# EAGLE schematic miniBTX (EAGLE 6.5.0)
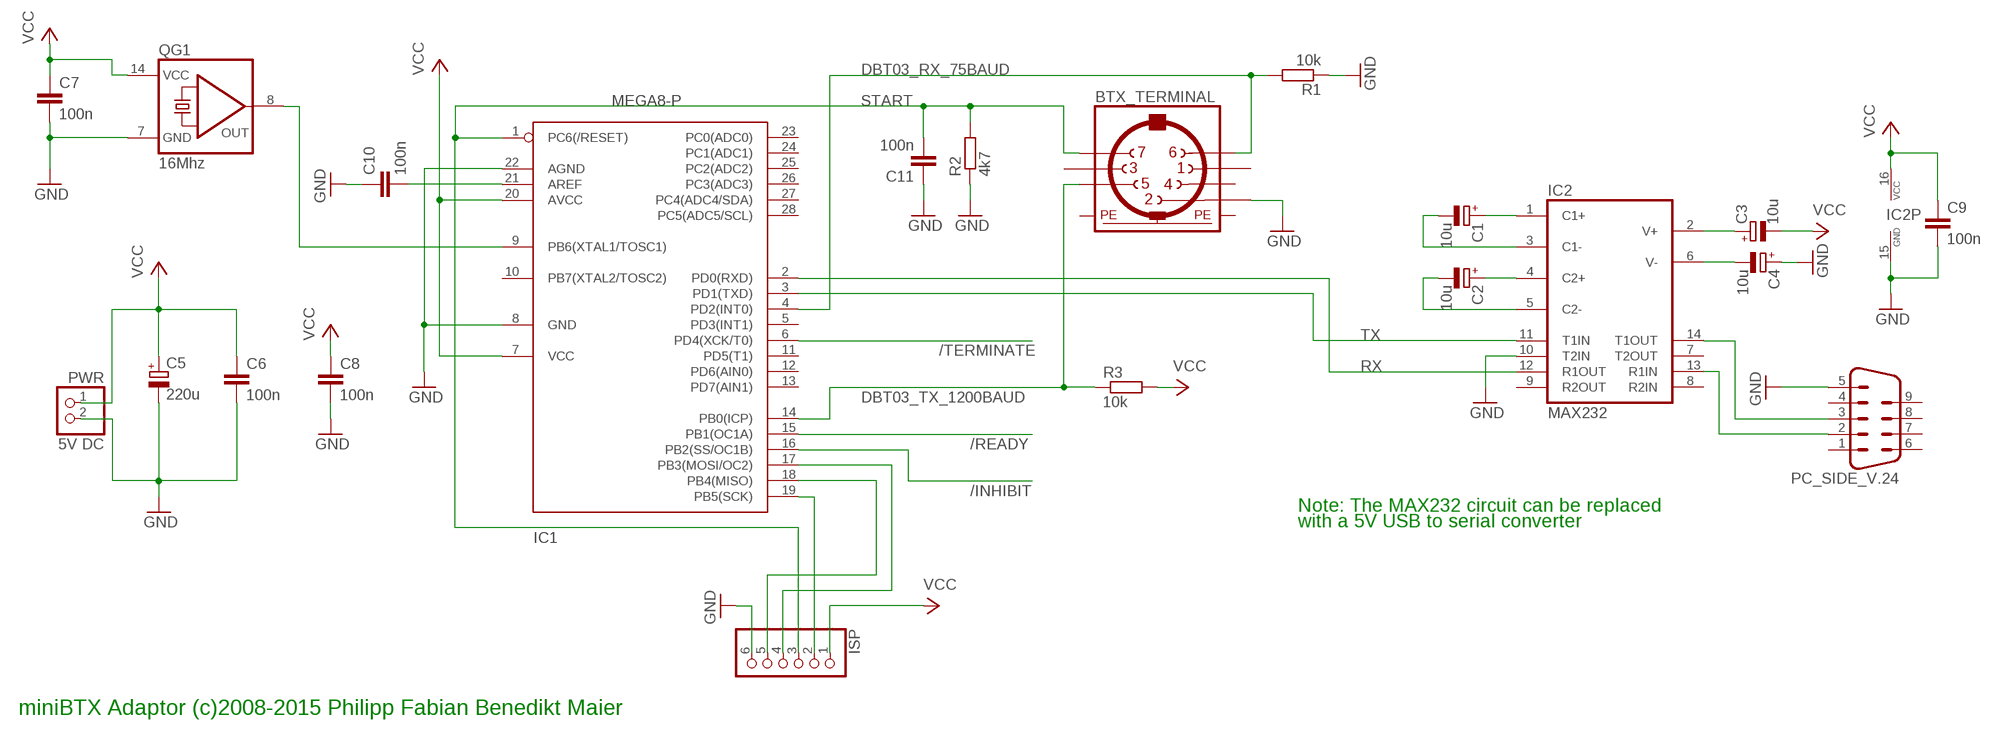
[diagram p0: schematic, sheet 1]

## Parts
BTX_TERMINAL  MAB7SH  [MAB7SH]
C1  10u  CPOL-EUE2,5-6E  [E2,5-6E]
C2  10u  CPOL-EUE2,5-6E  [E2,5-6E]
C3  10u  CPOL-EUE2,5-6E  [E2,5-6E]
C4  10u  CPOL-EUE2,5-6E  [E2,5-6E]
C5  220u  CPOL-EUE2,5-6E  [E2,5-6E]
C6  100n  C-EU025-024X044  [C025-024X044]
C7  100n  C-EU025-024X044  [C025-024X044]
C8  100n  C-EU025-024X044  [C025-024X044]
C9  100n  C-EU025-024X044  [C025-024X044]
C10  100n  C-EU025-024X044  [C025-024X044]
C11  100n  C-EU025-024X044  [C025-024X044]
IC1  MEGA8-P  [DIL28-3]
IC2  MAX232  [DIL16]
ISP  PINHD-1X6  [1X06]
PC_SIDE_V.24  M09HP  [M09HP]
PWR  5V DC  PINHD-1X2  [1X02]
QG1  16Mhz  QG5860  [DIL14S]
R1  10k  R-EU_0207/12  [0207/12]
R2  4k7  R-EU_0207/12  [0207/12]
R3  10k  R-EU_0207/12  [0207/12]

## Nets
/INHIBIT: IC1.16(PB2(SS/OC1B))
/READY: IC1.15(PB1(OC1A))
/TERMINATE: IC1.6(PD4(XCK/T0))
DBT03_RX_75BAUD: BTX_TERMINAL.6 IC1.4(PD2(INT0)) R1.2
DBT03_TX_1200BAUD: BTX_TERMINAL.5 IC1.14(PB0(ICP)) R3.1
GND: BTX_TERMINAL.2 C4.+ C5.- C6.2 C7.2 C8.2 C9.2 C10.1 C11.1 IC1.8(GND) IC1.22(AGND) IC2.10(T2IN) IC2.15(GND) ISP.6 PC_SIDE_V.24.5 PWR.2 QG1.7(GND) R1.1 R2.1
N$1: IC1.9(PB6(XTAL1/TOSC1)) QG1.8(OUT)
N$4: IC2.13(R1IN) PC_SIDE_V.24.2
N$5: C1.+ IC2.1(C1+)
N$6: C1.- IC2.3(C1-)
N$7: C2.+ IC2.4(C2+)
N$8: C2.- IC2.5(C2-)
N$9: C3.+ IC2.2(V+)
N$10: C4.- IC2.6(V-)
N$11: IC2.14(T1OUT) PC_SIDE_V.24.3
N$12: C10.2 IC1.21(AREF)
N$14: IC1.19(PB5(SCK)) ISP.2
N$16: IC1.17(PB3(MOSI/OC2)) ISP.4
N$17: IC1.18(PB4(MISO)) ISP.5
RX: IC1.2(PD0(RXD)) IC2.12(R1OUT)
START: BTX_TERMINAL.7 C11.2 IC1.1(PC6(/RESET)) ISP.3 R2.2
TX: IC1.3(PD1(TXD)) IC2.11(T1IN)
VCC: C3.- C5.+ C6.1 C7.1 C8.1 C9.1 IC1.7(VCC) IC1.20(AVCC) IC2.16(VCC) ISP.1 PWR.1 QG1.14(VCC) R3.2
Unconnected: BTX_TERMINAL.1 BTX_TERMINAL.3 BTX_TERMINAL.4 IC1.5(PD3(INT1)) IC1.10(PB7(XTAL2/TOSC2)) IC1.11(PD5(T1)) IC1.12(PD6(AIN0)) IC1.13(PD7(AIN1)) IC1.23(PC0(ADC0)) IC1.24(PC1(ADC1)) IC1.25(PC2(ADC2)) IC1.26(PC3(ADC3)) IC1.27(PC4(ADC4/SDA)) IC1.28(PC5(ADC5/SCL)) IC2.7(T2OUT) IC2.8(R2IN) IC2.9(R2OUT) PC_SIDE_V.24.1 PC_SIDE_V.24.4 PC_SIDE_V.24.6 PC_SIDE_V.24.7 PC_SIDE_V.24.8 PC_SIDE_V.24.9

## Notes on the sheet
- Note: The MAX232 circuit can be replaced
- with a 5V USB to serial converter
- miniBTX Adaptor (c)2008-2015 Philipp Fabian Benedikt Maier

## Power pins joined to a net without a drawn wire
PE: BTX_TERMINAL.PE BTX_TERMINAL.PE@(PE)

## Library data of the parts
BTX_TERMINAL = con-hirschmann:MAB7SH: Female CONNECTOR 7 pins with shield, horizontal (DIN 45329)
C1-C5 = rcl:CPOL-EU: POLARIZED CAPACITOR, European symbol
C6-C11 = rcl:C-EU: CAPACITOR, European symbol
IC1 = atmel:MEGA8-P: MICROCONTROLLER 8 Kbytes FLASH, 1 kbytes SRAM, 512 bytes EEPROM, USART, 4-channel 10 bit ADC, 2-channel 8 bit ADC Pin compatible with Atmega48, ATMega88, ATMega168 Source: avr.lbr
IC2 = maxim:MAX232: RS232 TRANSEIVER
ISP = pinhead:PINHD-1X6: PIN HEADER
PC_SIDE_V.24 = con-subd:M09: SUB-D
PWR = pinhead:PINHD-1X2: PIN HEADER
QG1 = crystal:QG5860: CRYSTAL RESONATOR
R1-R3 = rcl:R-EU_: RESISTOR, European symbol